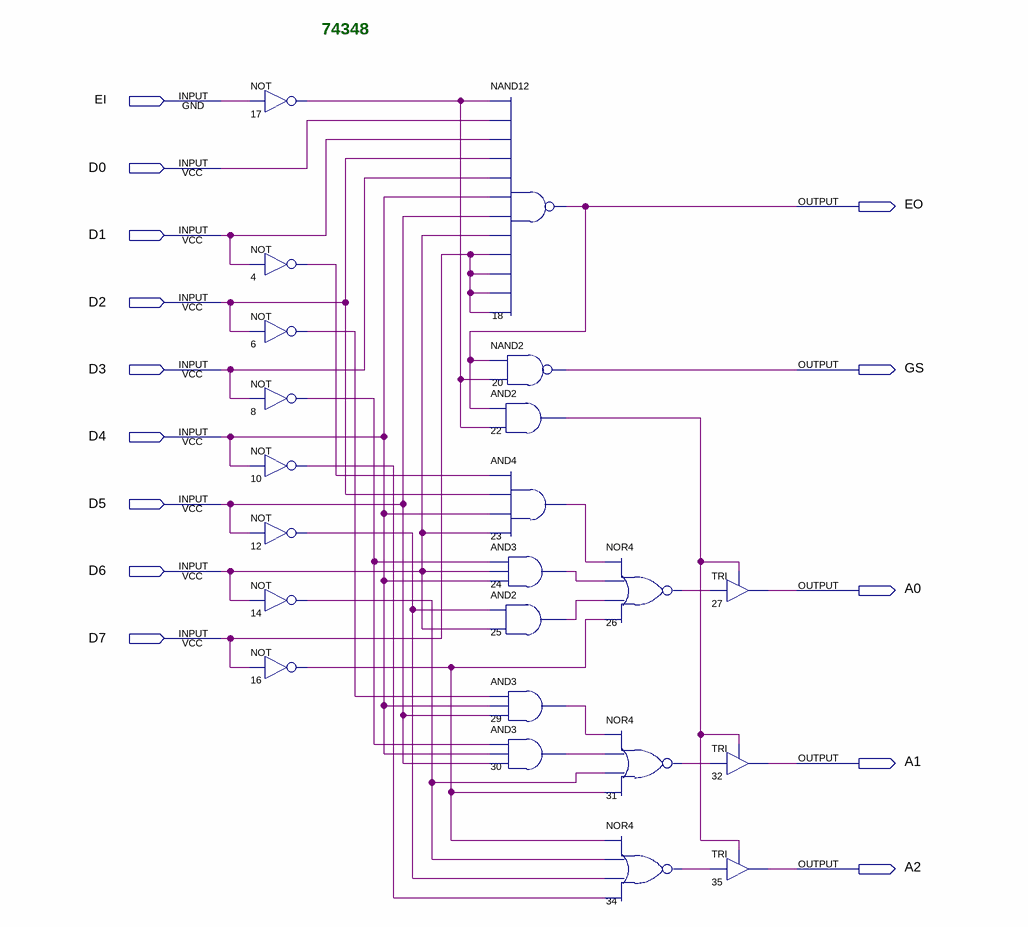
[diagram p0: schematic sheet]
// Quartus schematic 74348.bdf as structural Verilog: 22 symbols, 14 pins
module \74348  (
  input  EI,
  input  D0,
  input  D1,
  input  D2,
  input  D3,
  input  D4,
  input  D5,
  input  D6,
  input  D7,
  output EO,
  output GS,
  output A0,
  output A1,
  output A2
);

  wire n4_out, n6_out, n8_out, n10_out, n12_out, n14_out, n16_out, n17_out, n22_out, n23_out, n24_out,
       n25_out, n26_out, n29_out, n30_out, n31_out, n34_out;

  not u_17 (n17_out, EI);
  not u_4 (n4_out, D1);
  not u_6 (n6_out, D2);
  not u_8 (n8_out, D3);
  not u_10 (n10_out, D4);
  not u_12 (n12_out, D5);
  not u_14 (n14_out, D6);
  not u_16 (n16_out, D7);
  nand u_18 (EO, n17_out, D0, D1, D2, D3, D4, D5, D6, D7, D7, D7, D7);
  nand u_20 (GS, EO, n17_out);
  and u_22 (n22_out, EO, n17_out);
  and u_23 (n23_out, n4_out, D2, D4, D6);
  and u_24 (n24_out, n8_out, D6, D4);
  and u_25 (n25_out, n12_out, D6);
  and u_29 (n29_out, n6_out, D4, D5);
  and u_30 (n30_out, n8_out, D4, D5);
  nor u_26 (n26_out, n23_out, n24_out, n25_out, n16_out);
  nor u_31 (n31_out, n29_out, n30_out, n14_out, n16_out);
  nor u_34 (n34_out, n16_out, n14_out, n12_out, n10_out);
  TRI u_27 (.IN(n26_out), .OE(n22_out), .OUT(A0));
  TRI u_32 (.IN(n31_out), .OE(n22_out), .OUT(A1));
  TRI u_35 (.IN(n34_out), .OE(n22_out), .OUT(A2));

  // Notes on the sheet:
  //   74348
endmodule
